# Altium schematic sheet Э3_2.SchDoc: =title_line_1 + title_line_2
size 420 x 297 mm; ApprovedBy: Мерзлякова; CheckedBy: Кутузов; DrawnBy: Площадная; DocumentNumber: Э3; SheetNumber: 2; SheetTotal: 2; DocumentCode: Э3; title_line_1: плата; title_line_2: ЕТЗ; document_type: схема электрическая принципиальная; check: Кутузов
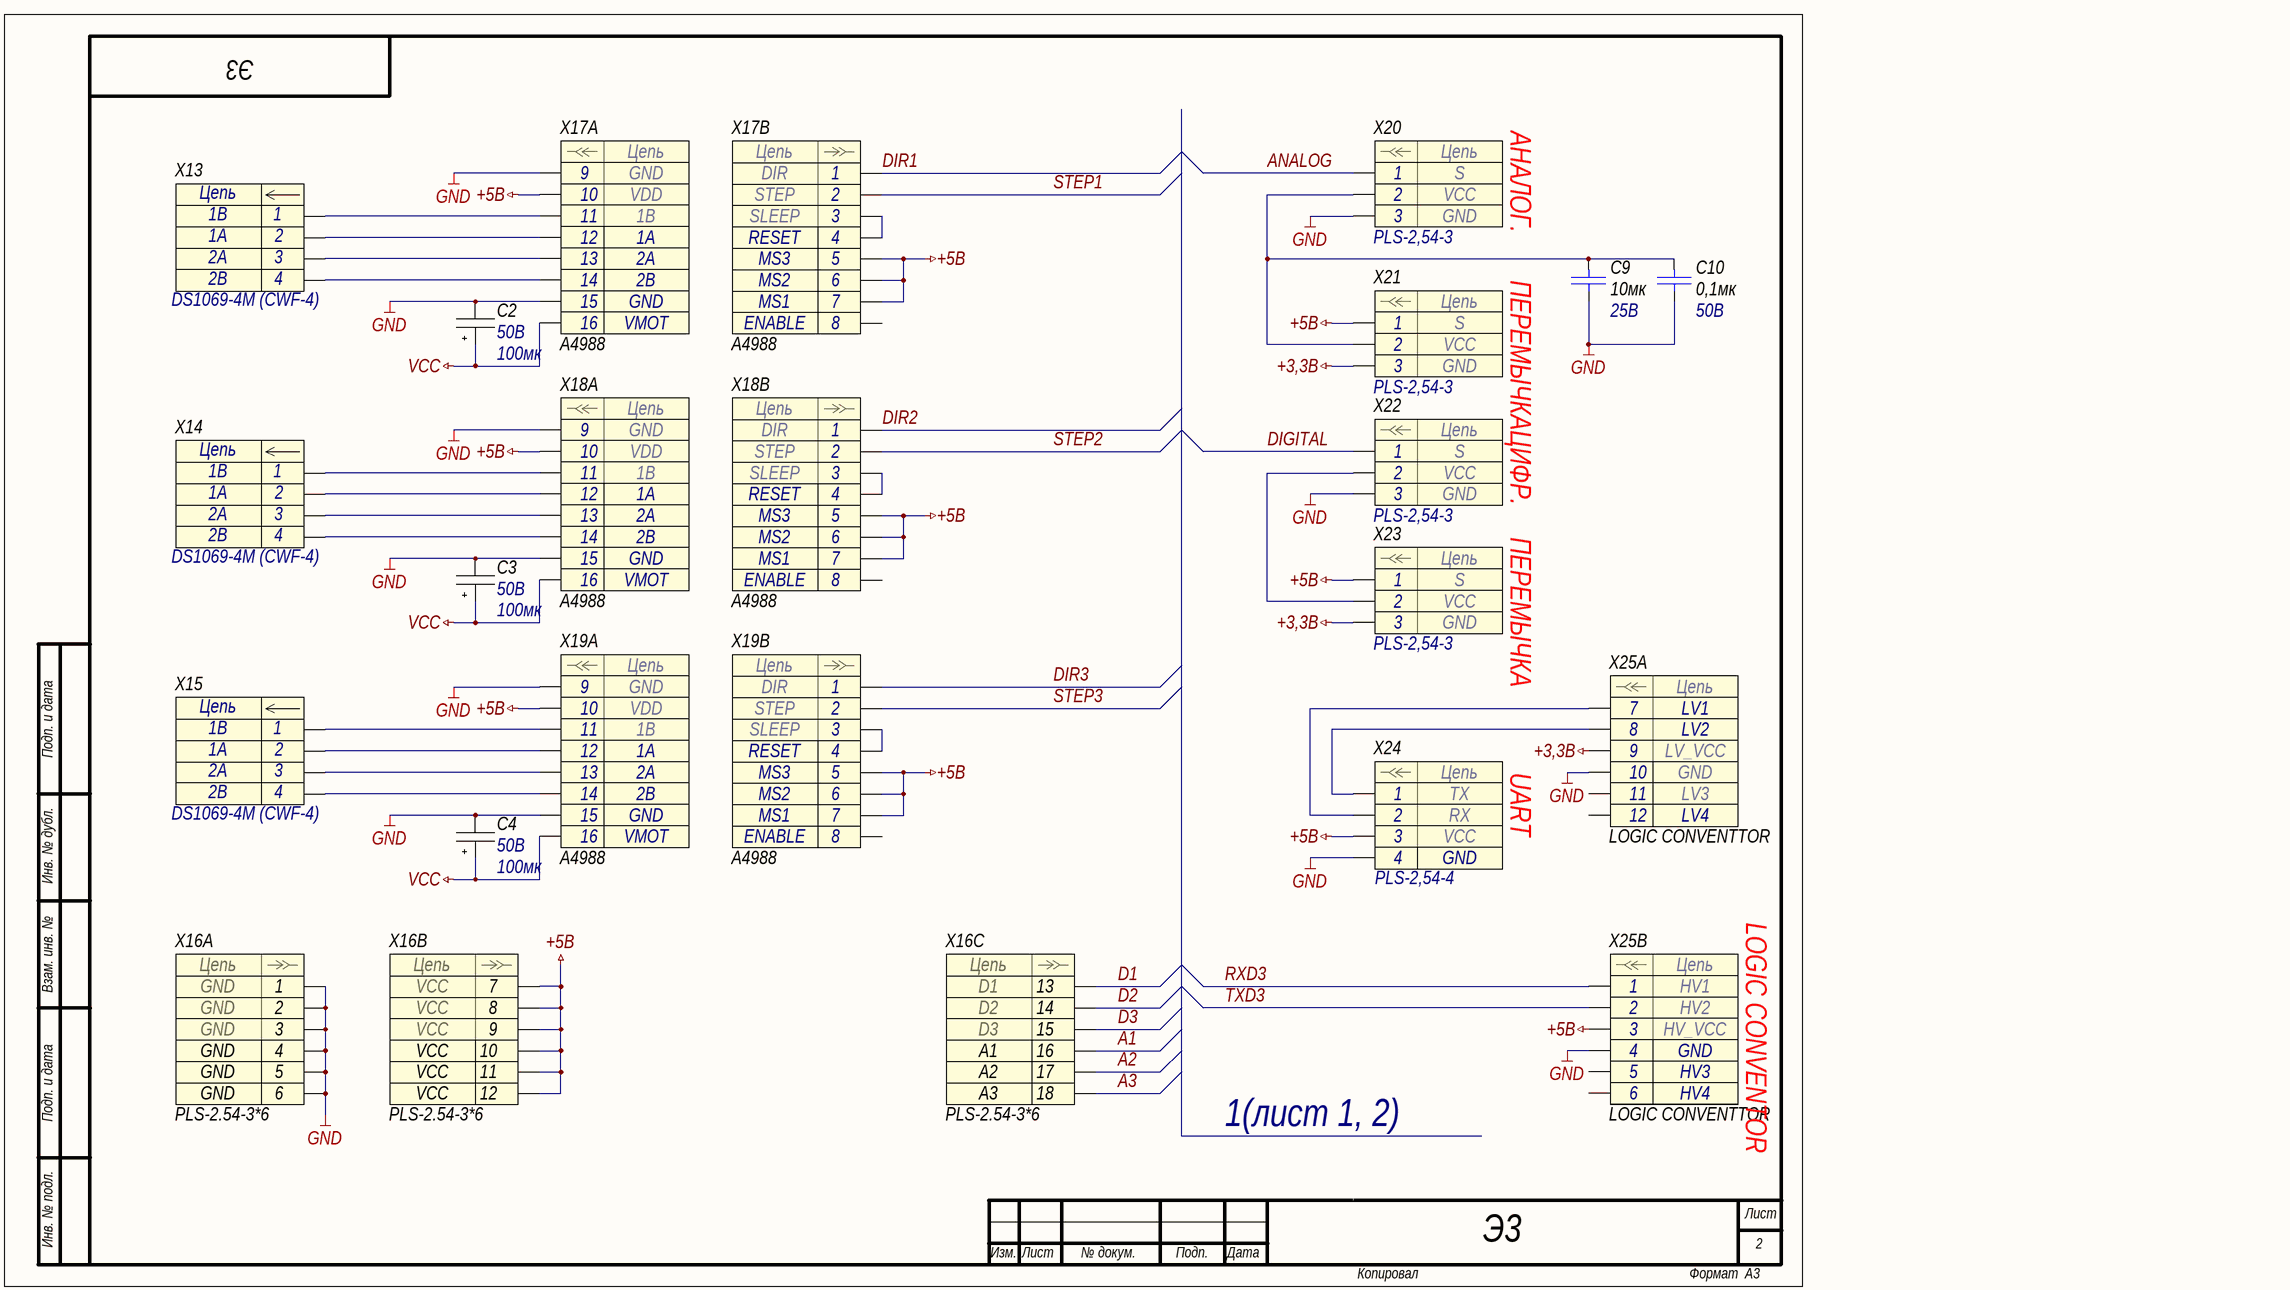
[diagram p0: Э3_2.SchDoc]

## Parts
C2  voltage: 50В  nominal: 100мк  [SK050M0100B3F-0811-up]  (hidden comment: конденсатор)
C3  voltage: 50В  nominal: 100мк  [SK050M0100B3F-0811-up]  (hidden comment: конденсатор)
C4  voltage: 50В  nominal: 100мк  [SK050M0100B3F-0811-up]  (hidden comment: конденсатор)
C9  10мк  Voltage: 25В  [C1206]
C10  0,1мк  Voltage: 50В  [C0603]
X13  DS1069-4M (CWF-4)  [CWF-4]
X14  DS1069-4M (CWF-4)  [CWF-4]
X15  DS1069-4M (CWF-4)  [CWF-4]
X16  PLS-2.54-3*6  [PLS-2.54-3*6]  (parts A,B,C of 3)
X17  A4988  [A4988]  (parts A,B of 2)
X18  A4988  [A4988]  (parts A,B of 2)
X19  A4988  [A4988]  (parts A,B of 2)
X20  PLS-2,54-3  [PLS-2.54-3]
X21  PLS-2,54-3  [PLS-2.54-3]
X22  PLS-2,54-3  [PLS-2.54-3]
X23  PLS-2,54-3  [PLS-2.54-3]
X24  PLS-2,54-4  [PLS-2.54-4]
X25  LOGIC CONVENTTOR  [LOGIC CONVENTOR]  (parts A,B of 2)

## Nets
+3,3В: X21.3 X23.3 X25.9
+5В: X16.7 X16.8 X16.9 X16.10 X16.11 X16.12 X17.5 X17.6 X17.7 X17.10 X18.5 X18.6 X18.7 X18.10 X19.5 X19.6 X19.7 X19.10 X21.1 X23.1 X24.3 X25.3
GND: C2.2 C3.2 C4.2 C9.1 C10.1 X16.1 X16.2 X16.3 X16.4 X16.5 X16.6 X17.9 X17.15 X18.9 X18.15 X19.9 X19.15 X20.3 X22.3 X24.4 X25.4 X25.10
VCC: C2.1 C3.1 C4.1 X17.16 X18.16 X19.16
A1: X16.16
A2: X16.17
A3: X16.18
ANALOG: X20.1
D1: X16.13
D2: X16.14
D3: X16.15
DIGITAL: X22.1
DIR1: X17.1
DIR2: X18.1
DIR3: X19.1
RXD3: X25.1
STEP1: X17.2
STEP2: X18.2
STEP3: X19.2
TXD3: X25.2
NetC9_2: C9.2 C10.2 X20.2 X21.2
NetX13_1: X13.1 X17.11
NetX13_2: X13.2 X17.12
NetX13_3: X13.3 X17.13
NetX13_4: X13.4 X17.14
NetX14_1: X14.1 X18.11
NetX14_2: X14.2 X18.12
NetX14_3: X14.3 X18.13
NetX14_4: X14.4 X18.14
NetX15_1: X15.1 X19.11
NetX15_2: X15.2 X19.12
NetX15_3: X15.3 X19.13
NetX15_4: X15.4 X19.14
NetX17_3: X17.3 X17.4
NetX18_3: X18.3 X18.4
NetX19_3: X19.3 X19.4
NetX22_2: X22.2 X23.2
NetX24_1: X24.1 X25.8
NetX24_2: X24.2 X25.7

Not connected (* = marked no-connect by the designer): X17 8; X18 8; X19 8; X25 5 6 11 12

## Notes on the sheet
- АНАЛОГ.
- ПЕРЕМЫЧКА
- ЦИФР.
- UART
- LOGIC CONVENTOR
- 1(лист 1, 2)
- Подп. и дата
- Инв. № дубл.
- Взам. инв. №
- Инв. № подл.
- Лист
- Изм.
- № докум.
- Подп.
- Дата
- Копировал
- Формат
- А3
- (in symbol A4988, part A) Цепь; GND; VDD; 1B; 1A; 2A; 2B; VMOT
- (in symbol A4988, part B) Цепь; DIR; STEP; SLEEP; RESET; MS3; MS2; MS1; ENABLE
- (in symbol CWF-4) Цепь
- (in symbol LOGIC CONVENTTOR, part A) Цепь; LV1; LV2; LV_VCC; GND; LV3; LV4
- (in symbol LOGIC CONVENTTOR, part B) Цепь; HV1; HV2; HV_VCC; GND; HV3; HV4
- (in symbol PLS-2.54-3 1>2) Цепь
- (in symbol PLS-2.54-3*6, part A) Цепь
- (in symbol PLS-2.54-3*6, part B) Цепь
- (in symbol PLS-2.54-3*6, part C) Цепь
- (in symbol PLS-2.54-4) Цепь

## Library data of the parts
C2-C4 = SK050M0100B3F-0811: nam: конденсатор
C9 = CC1206KKX7R8BB106: Конденсатор кер. 10мкФ 25В; Manufacturer: Yageo; TKE: X7R; Name: CC1206KKX7R8BB106; Value: 10мк
C10 = GRM188R71H104KA93D: Конденсатор кер. 0,1мкФ 50В X7R; Manufacturer: Murata; Name: GRM188R71H104KA93D; TKE: X7R; Value: 0,1мк
X13-X15 = CWF-4: Разъем - 4 конт. прямая вилка на плату; Contact_1: 1B; Contact_2: 1A; Contact_3: 2A; Contact_4: 2B; Name: DS1069-4M (CWF-4)
X16 = PLS-2.54-3*6: Contact_1: GND; Contact_7: VCC; Contact_2: GND; Contact_3: GND; Contact_4: GND; Contact_5: GND; Contact_6: GND; Contact_8: VCC; Contact_9: VCC; Contact_10: VCC; Contact_11: VCC; Contact_12: VCC; Contact_13: *; Contact_14: *; Contact_15: *; Contact_16: *; Contact_17: *; Contact_18: *
X20-X23 = PLS-2.54-3 1>2: Contact_1: S; Contact_2: VCC; Contact_3: GND; nam: PLS-2,54-3
X24 = PLS-2.54-4: Contact_1: TX; Contact_2: RX; Contact_3: VCC; Contact_4: GND; nam: PLS-2,54-4